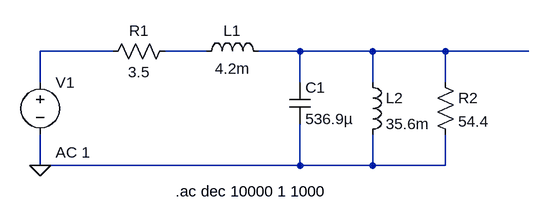
[diagram p0: schematic thor.asc]
thor.asc, the LTspice schematic file:
Version 4
SHEET 1 880 680
WIRE 176 -64 64 -64
WIRE 320 -64 256 -64
WIRE 464 -64 400 -64
WIRE 576 -64 464 -64
WIRE 688 -64 576 -64
WIRE 816 -64 688 -64
WIRE 64 -16 64 -64
WIRE 464 -16 464 -64
WIRE 576 -16 576 -64
WIRE 688 -16 688 -64
WIRE 64 112 64 64
WIRE 464 112 464 48
WIRE 464 112 64 112
WIRE 576 112 576 64
WIRE 576 112 464 112
WIRE 688 112 688 64
WIRE 688 112 576 112
FLAG 64 112 0
SYMBOL voltage 64 -32 R0
WINDOW 123 24 124 Left 2
WINDOW 39 0 0 Left 0
SYMATTR Value2 AC 1
SYMATTR InstName V1
SYMATTR Value ""
SYMBOL res 272 -80 R90
WINDOW 0 0 56 VBottom 2
WINDOW 3 32 56 VTop 2
SYMATTR InstName R1
SYMATTR Value 3.5
SYMBOL ind 304 -48 R270
WINDOW 0 32 56 VTop 2
WINDOW 3 5 56 VBottom 2
SYMATTR InstName L1
SYMATTR Value 4.2m
SYMBOL cap 448 -16 R0
SYMATTR InstName C1
SYMATTR Value 536.9µ
SYMBOL ind 560 -32 R0
SYMATTR InstName L2
SYMATTR Value 35.6m
SYMBOL res 672 -32 R0
SYMATTR InstName R2
SYMATTR Value 54.4
TEXT 272 152 Left 2 !.ac dec 10000 1 1000

The netlist it stands for:
* thor.asc
V1 N001 0 AC 1
R1 N002 N001 3.5
L1 N002 N003 4.2m
C1 N003 0 536.9µ
L2 N003 0 35.6m
R2 N003 0 54.4
.ac dec 10000 1 1000
.backanno
.end